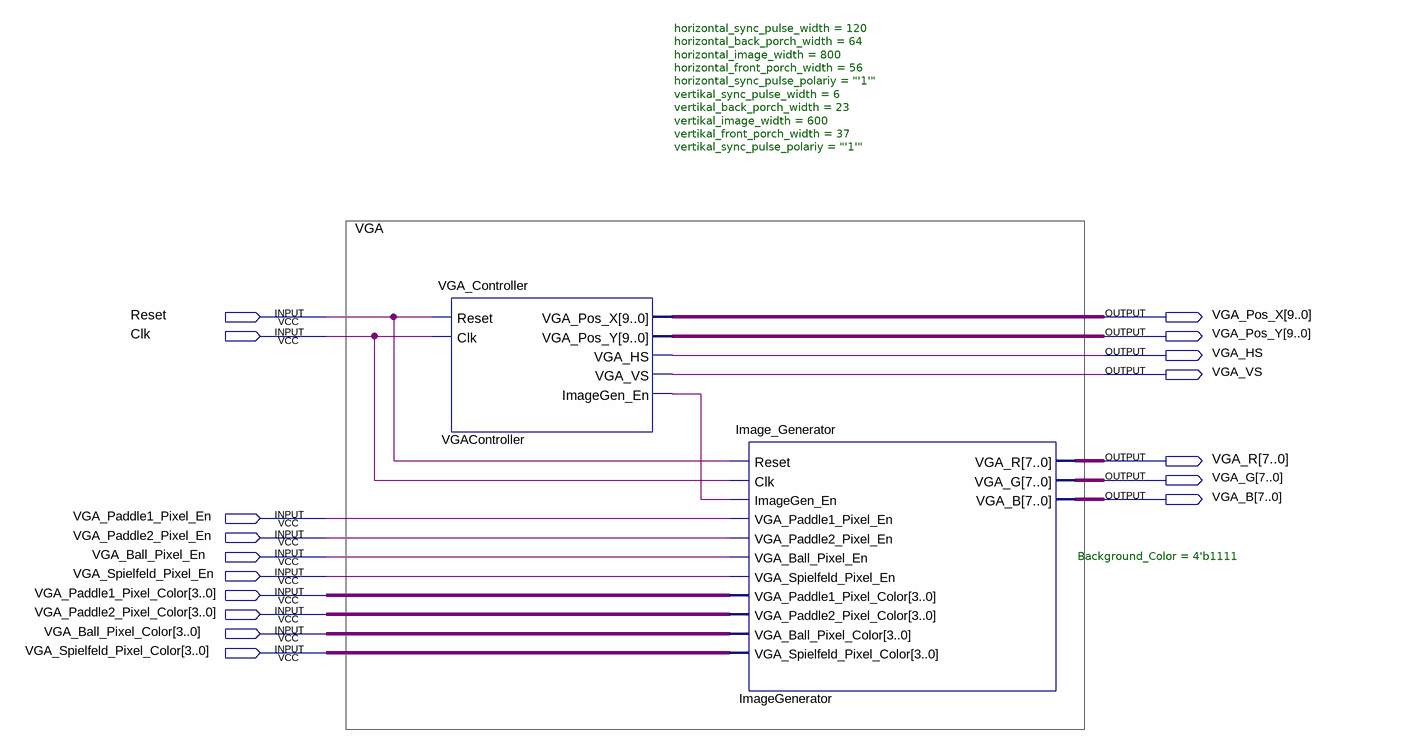
[diagram p0: schematic sheet]
// Quartus schematic VGA_Block.bdf as structural Verilog: 2 symbols, 17 pins
module VGA_Block (
  input  Reset,
  input  Clk,
  input  VGA_Paddle1_Pixel_En,
  input  VGA_Paddle2_Pixel_En,
  input  VGA_Ball_Pixel_En,
  input  VGA_Spielfeld_Pixel_En,
  input  [3:0] VGA_Paddle1_Pixel_Color,
  input  [3:0] VGA_Paddle2_Pixel_Color,
  input  [3:0] VGA_Ball_Pixel_Color,
  input  [3:0] VGA_Spielfeld_Pixel_Color,
  output [9:0] VGA_Pos_X,
  output [9:0] VGA_Pos_Y,
  output VGA_HS,
  output VGA_VS,
  output [7:0] VGA_R,
  output [7:0] VGA_G,
  output [7:0] VGA_B
);

  wire VGAController_imagegen_en;

  VGA_Controller #(.horizontal_sync_pulse_width(120), .horizontal_back_porch_width(64), .horizontal_image_width(800), .horizontal_front_porch_width(56), .horizontal_sync_pulse_polariy("'1'"), .vertikal_sync_pulse_width(6), .vertikal_back_porch_width(23), .vertikal_image_width(600), .vertikal_front_porch_width(37), .vertikal_sync_pulse_polariy("'1'")) VGAController (
    .Reset(Reset), .Clk(Clk), .VGA_Pos_X(VGA_Pos_X), .VGA_Pos_Y(VGA_Pos_Y), .VGA_HS(VGA_HS), .VGA_VS(VGA_VS),
    .ImageGen_En(VGAController_imagegen_en));
  Image_Generator #(.Background_Color(4'b1111)) ImageGenerator (
    .Reset(Reset), .Clk(Clk), .ImageGen_En(VGAController_imagegen_en),
    .VGA_Paddle1_Pixel_En(VGA_Paddle1_Pixel_En), .VGA_Paddle2_Pixel_En(VGA_Paddle2_Pixel_En),
    .VGA_Ball_Pixel_En(VGA_Ball_Pixel_En), .VGA_Spielfeld_Pixel_En(VGA_Spielfeld_Pixel_En),
    .VGA_Paddle1_Pixel_Color(VGA_Paddle1_Pixel_Color), .VGA_Paddle2_Pixel_Color(VGA_Paddle2_Pixel_Color),
    .VGA_Ball_Pixel_Color(VGA_Ball_Pixel_Color), .VGA_Spielfeld_Pixel_Color(VGA_Spielfeld_Pixel_Color),
    .VGA_R(VGA_R), .VGA_G(VGA_G), .VGA_B(VGA_B));

  // Notes on the sheet:
  //   VGA
endmodule
